# Altium schematic sheet MCU.SchDoc
size A3; Revision: D.1(PCB.SCH)
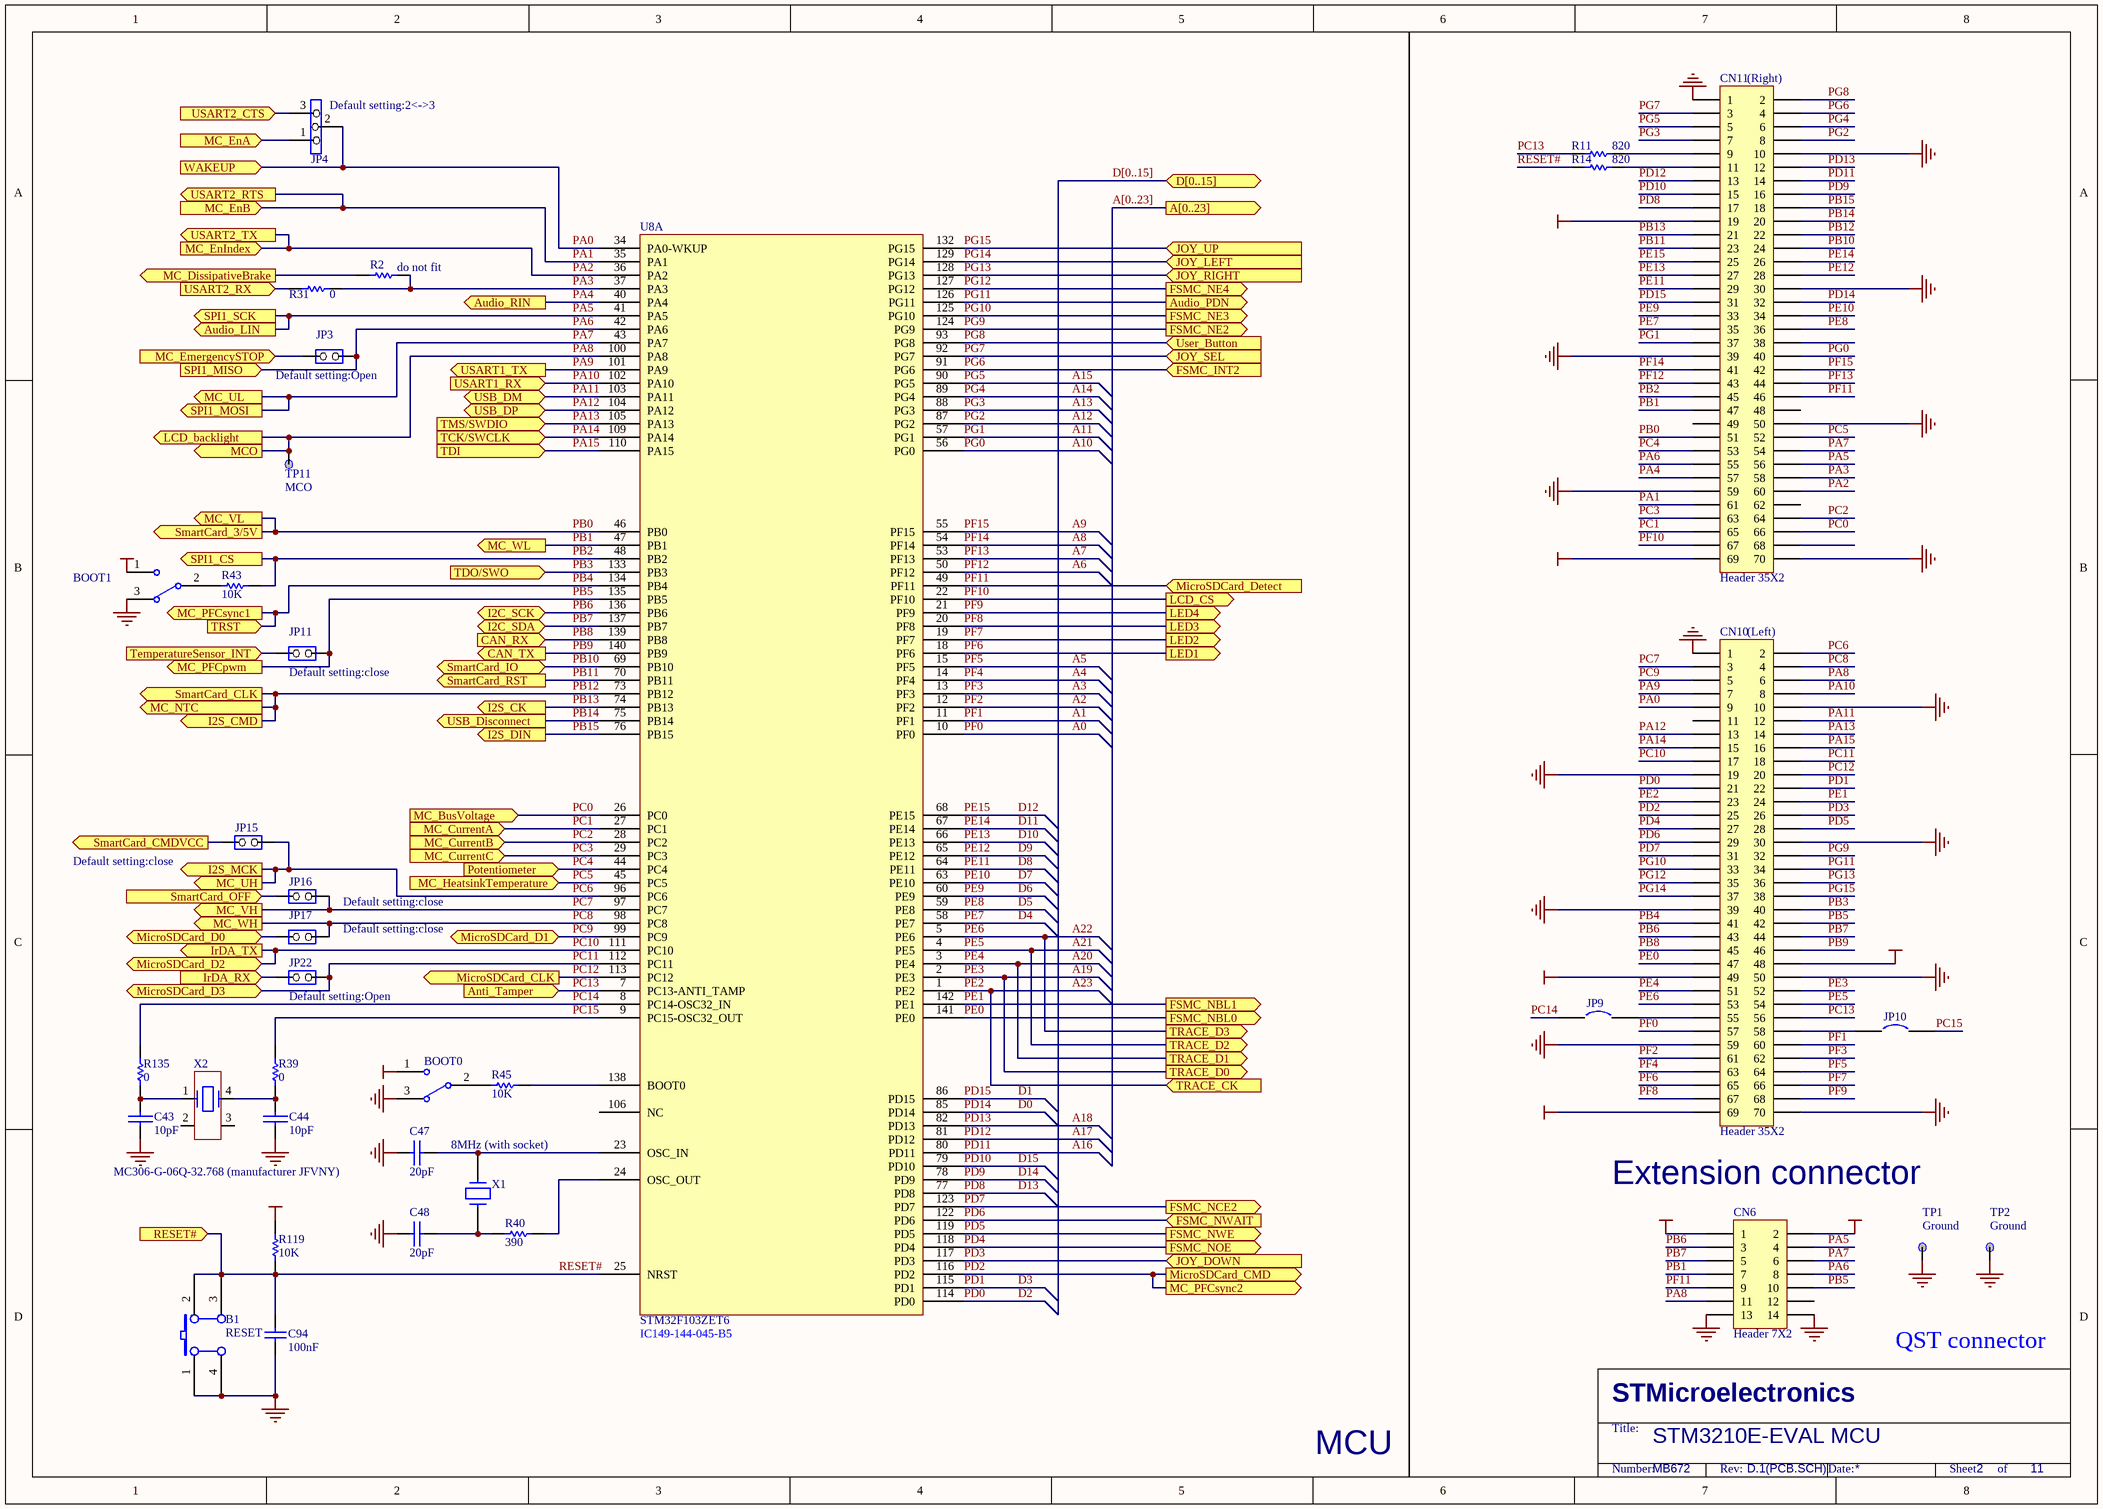
[diagram p0: MCU.SchDoc]

## Parts
B1  RESET  [PB10]
BOOT0  (no value)  [SIP3]
BOOT1  (no value)  [SIP3]
C43  10pF  [0603]
C44  10pF  [0603]
C47  20pF  [0603]
C48  20pF  [0603]
C94  100nF  [0603P]
CN6  Header 7X2  [HDR2X7]
CN10  Header 35X2
CN11  Header 35X2
JP3  (no value)  [SIP2]
JP4  (no value)  [SIP3]
JP9  (no value)  [SPST-2]
JP10  (no value)  [SPST-2]
JP11  (no value)  [SIP2]
JP15  (no value)  [SIP2]
JP16  (no value)  [SIP2]
JP17  (no value)  [SIP2]
JP22  (no value)  [SIP2]
R2  do not fit  [0603]
R11  820  [0603]
R14  820  [0603]
R31  0  [0603]
R39  0  [0805]
R40  390  [0603]
R43  10K  [0603]
R45  10K  [0603]
R119  10K  [0603]
R135  0  [0805]
TP1  Ground  [TP]
TP2  Ground  [TP]
TP11  MCO  [TP]
U8  STM32F103ZET6  (part A of 2)
X1  8MHz (with socket)  [XTAL1]
X2  MC306-G-06Q-32.768 (manufacturer JFVNY)  [SM8]

## Ports
A[0..23] (out), Anti_Tamper (in), Audio_LIN (out), Audio_PDN (out), Audio_RIN (out), CAN_RX (in), CAN_TX (out), D[0..15] (bidir), FSMC_INT2 (in), FSMC_NBL0 (out), FSMC_NBL1 (out), FSMC_NCE2 (out), FSMC_NE2 (out), FSMC_NE3 (out), FSMC_NE4 (out), FSMC_NOE (out), FSMC_NWAIT (in), FSMC_NWE (out), I2C_SCK (bidir), I2C_SDA (bidir), I2S_CK (out), I2S_CMD (out), I2S_DIN (out), I2S_MCK (out), IrDA_RX (in), IrDA_TX (out), JOY_DOWN (in), JOY_LEFT (in), JOY_RIGHT (in), JOY_SEL (in), JOY_UP (in), LCD_backlight (out), LCD_CS (out), LED1 (out), LED2 (out), LED3 (out), LED4 (out), MC_BusVoltage (in), MC_CurrentA (in), MC_CurrentB (in), MC_CurrentC (in), MC_DissipativeBrake (out), MC_EmergencySTOP (in), MC_EnA (in), MC_EnB (in), MC_EnIndex (in), MC_HeatsinkTemperature (in), MC_NTC (out), MC_PFCpwm (out), MC_PFCsync1 (out), MC_PFCsync2 (out), MC_UH (out), MC_UL (out), MC_VH (out), MC_VL (out), MC_WH (out), MC_WL (out), MCO (out), MicroSDCard_CLK (out), MicroSDCard_CMD (out), MicroSDCard_D0 (bidir), MicroSDCard_D1 (bidir), MicroSDCard_D2 (bidir), MicroSDCard_D3 (bidir), MicroSDCard_Detect (in), Potentiometer (in), RESET# (in), SmartCard_3/5V (out), SmartCard_CLK (out), SmartCard_CMDVCC (out), SmartCard_IO (bidir), SmartCard_OFF (in), SmartCard_RST (out), SPI1_CS (out), SPI1_MISO (in), SPI1_MOSI (out), SPI1_SCK (out), TCK/SWCLK (in), TDI (in), TDO/SWO (in), TemperatureSensor_INT (in), TMS/SWDIO (in), TRACE_CK (in), TRACE_D0 (out), TRACE_D1 (out), TRACE_D2 (out), TRACE_D3 (out), TRST (in), USART1_RX (in), USART1_TX (out), USART2_CTS (in), USART2_RTS (out), USART2_RX (in), USART2_TX (out), USB_Disconnect (out), USB_DM (bidir), USB_DP (bidir), User_Button (in), WAKEUP (in)

## Nets
+3V3: BOOT0.1 BOOT1.1 CN10.48 CN10.69 CN11.69 R119.2
+5V: CN6.1 CN6.2
D5V: CN10.49 CN11.19
GND: B1.1(A0) B1.4(A1) BOOT0.3 BOOT1.3 C43.2 C44.2 C47.2 C48.2 C94.1 CN6.13 CN6.14 CN10.1 CN10.10 CN10.19 CN10.30 CN10.39 CN10.50 CN10.59 CN10.70 CN11.1 CN11.10 CN11.30 CN11.39 CN11.50 CN11.59 CN11.70 TP1.1 TP2.1
A0: CN10.57 U8.10(PF0)  [also labelled PF0]
A1: CN10.60 U8.11(PF1)  [also labelled PF1]
A2: CN10.61 U8.12(PF2)  [also labelled PF2]
A3: CN10.62 U8.13(PF3)  [also labelled PF3]
A4: CN10.63 U8.14(PF4)  [also labelled PF4]
A5: CN10.64 U8.15(PF5)  [also labelled PF5]
A6: CN11.43 U8.50(PF12)  [also labelled PF12]
A7: CN11.44 U8.53(PF13)  [also labelled PF13]
A8: CN11.41 U8.54(PF14)  [also labelled PF14]
A9: CN11.42 U8.55(PF15)  [also labelled PF15]
A10: CN11.40 U8.56(PG0)  [also labelled PG0]
A11: CN11.37 U8.57(PG1)  [also labelled PG1]
A12: CN11.8 U8.87(PG2)  [also labelled PG2]
A13: CN11.7 U8.88(PG3)  [also labelled PG3]
A14: CN11.6 U8.89(PG4)  [also labelled PG4]
A15: CN11.5 U8.90(PG5)  [also labelled PG5]
A16: CN11.14 U8.80(PD11)  [also labelled PD11]
A17: CN11.13 U8.81(PD12)  [also labelled PD12]
A18: CN11.12 U8.82(PD13)  [also labelled PD13]
A19: CN10.52 U8.2(PE3) ; port TRACE_D0  [also labelled PE3]
A20: CN10.51 U8.3(PE4) ; port TRACE_D1  [also labelled PE4]
A21: CN10.54 U8.4(PE5) ; port TRACE_D2  [also labelled PE5]
A22: CN10.53 U8.5(PE6) ; port TRACE_D3  [also labelled PE6]
A23: CN10.23 U8.1(PE2) ; port TRACE_CK  [also labelled PE2]
D0: CN11.32 U8.85(PD14)  [also labelled PD14]
D1: CN11.31 U8.86(PD15)  [also labelled PD15]
D2: CN10.21 U8.114(PD0)  [also labelled PD0]
D3: CN10.22 U8.115(PD1)  [also labelled PD1]
D4: CN11.35 U8.58(PE7)  [also labelled PE7]
D5: CN11.36 U8.59(PE8)  [also labelled PE8]
D6: CN11.33 U8.60(PE9)  [also labelled PE9]
D7: CN11.34 U8.63(PE10)  [also labelled PE10]
D8: CN11.29 U8.64(PE11)  [also labelled PE11]
D9: CN11.28 U8.65(PE12)  [also labelled PE12]
D10: CN11.27 U8.66(PE13)  [also labelled PE13]
D11: CN11.26 U8.67(PE14)  [also labelled PE14]
D12: CN11.25 U8.68(PE15)  [also labelled PE15]
D13: CN11.17 U8.77(PD8)  [also labelled PD8]
D14: CN11.16 U8.78(PD9)  [also labelled PD9]
D15: CN11.15 U8.79(PD10)  [also labelled PD10]
IrDA_RX: JP22.2(NO) ; port IrDA_RX
MC_DissipativeBrake: R2.2 ; port MC_DissipativeBrake
MC_EmergencySTOP: JP3.2(NO) ; port MC_EmergencySTOP
MC_EnA: JP4.1 ; port MC_EnA
MicroSDCard_D0: JP17.2(NO) ; port MicroSDCard_D0
PA0: CN10.9 JP4.2 U8.34(PA0-WKUP) ; port WAKEUP
PA1: CN11.61 U8.35(PA1) ; port USART2_RTS, port MC_EnB
PA2: CN11.60 U8.36(PA2) ; port USART2_TX, port MC_EnIndex
PA3: CN11.58 R2.1 R31.1 U8.37(PA3)
PA4: CN11.57 U8.40(PA4) ; port Audio_RIN
PA5: CN6.4 CN11.56 U8.41(PA5) ; port SPI1_SCK, port Audio_LIN
PA6: CN6.8 CN11.55 JP3.1(COMMON) U8.42(PA6) ; port SPI1_MISO
PA7: CN6.6 CN11.54 U8.43(PA7) ; port MC_UL, port SPI1_MOSI
PA8: CN6.11 CN10.6 TP11.1 U8.100(PA8) ; port LCD_backlight, port MCO
PA9: CN10.7 U8.101(PA9) ; port USART1_TX
PA10: CN10.8 U8.102(PA10) ; port USART1_RX
PA11: CN10.12 U8.103(PA11) ; port USB_DM
PA12: CN10.13 U8.104(PA12) ; port USB_DP
PA13: CN10.14 U8.105(PA13) ; port TMS/SWDIO
PA14: CN10.15 U8.109(PA14) ; port TCK/SWCLK
PA15: CN10.16 U8.110(PA15) ; port TDI
PB0: CN11.51 U8.46(PB0) ; port MC_VL, port SmartCard_3/5V
PB1: CN6.7 CN11.47 U8.47(PB1) ; port MC_WL
PB2: CN11.45 R43.1 U8.48(PB2) ; port SPI1_CS
PB3: CN10.40 U8.133(PB3) ; port TDO/SWO
PB4: CN10.41 U8.134(PB4) ; port TRST, port MC_PFCsync1
PB5: CN6.10 CN10.42 JP11.1(COMMON) U8.135(PB5) ; port MC_PFCpwm
PB6: CN6.3 CN10.43 U8.136(PB6) ; port I2C_SCK
PB7: CN6.5 CN10.44 U8.137(PB7) ; port I2C_SDA
PB8: CN10.45 U8.139(PB8) ; port CAN_RX
PB9: CN10.46 U8.140(PB9) ; port CAN_TX
PB10: CN11.24 U8.69(PB10) ; port SmartCard_IO
PB11: CN11.23 U8.70(PB11) ; port SmartCard_RST
PB12: CN11.22 U8.73(PB12) ; port I2S_CMD, port MC_NTC, port SmartCard_CLK
PB13: CN11.21 U8.74(PB13) ; port I2S_CK
PB14: CN11.20 U8.75(PB14) ; port USB_Disconnect
PB15: CN11.18 U8.76(PB15) ; port I2S_DIN
PC0: CN11.66 U8.26(PC0) ; port MC_BusVoltage
PC1: CN11.65 U8.27(PC1) ; port MC_CurrentA
PC2: CN11.64 U8.28(PC2) ; port MC_CurrentB
PC3: CN11.63 U8.29(PC3) ; port MC_CurrentC
PC4: CN11.53 U8.44(PC4) ; port Potentiometer
PC5: CN11.52 U8.45(PC5) ; port MC_HeatsinkTemperature
PC6: CN10.2 JP15.1(COMMON) U8.96(PC6) ; port MC_UH, port I2S_MCK
PC7: CN10.3 JP16.1(COMMON) U8.97(PC7) ; port MC_VH
PC8: CN10.4 JP17.1(COMMON) U8.98(PC8) ; port MC_WH
PC9: CN10.5 U8.99(PC9) ; port MicroSDCard_D1
PC10: CN10.17 U8.111(PC10) ; port IrDA_TX, port MicroSDCard_D2
PC11: CN10.18 JP22.1(COMMON) U8.112(PC11) ; port MicroSDCard_D3
PC12: CN10.20 U8.113(PC12) ; port MicroSDCard_CLK
PC13: CN10.56 R11.1 U8.7(PC13-ANTI_TAMP) ; port Anti_Tamper
PC14: JP9.1 R135.2 U8.8(PC14-OSC32_IN)
PC15: JP10.2 R39.2 U8.9(PC15-OSC32_OUT)
PD2: CN10.25 U8.116(PD2) ; port MC_PFCsync2, port MicroSDCard_CMD
PD3: CN10.26 U8.117(PD3) ; port JOY_DOWN
PD4: CN10.27 U8.118(PD4) ; port FSMC_NOE
PD5: CN10.28 U8.119(PD5) ; port FSMC_NWE
PD6: CN10.29 U8.122(PD6) ; port FSMC_NWAIT
PD7: CN10.31 U8.123(PD7) ; port FSMC_NCE2
PE0: CN10.47 U8.141(PE0) ; port FSMC_NBL0
PE1: CN10.24 U8.142(PE1) ; port FSMC_NBL1
PF6: CN10.65 U8.18(PF6) ; port LED1
PF7: CN10.66 U8.19(PF7) ; port LED2
PF8: CN10.67 U8.20(PF8) ; port LED3
PF9: CN10.68 U8.21(PF9) ; port LED4
PF10: CN11.67 U8.22(PF10) ; port LCD_CS
PF11: CN6.9 CN11.46 U8.49(PF11) ; port MicroSDCard_Detect
PG6: CN11.4 U8.91(PG6) ; port FSMC_INT2
PG7: CN11.3 U8.92(PG7) ; port JOY_SEL
PG8: CN11.2 U8.93(PG8) ; port User_Button
PG9: CN10.32 U8.124(PG9) ; port FSMC_NE2
PG10: CN10.33 U8.125(PG10) ; port FSMC_NE3
PG11: CN10.34 U8.126(PG11) ; port Audio_PDN
PG12: CN10.35 U8.127(PG12) ; port FSMC_NE4
PG13: CN10.36 U8.128(PG13) ; port JOY_RIGHT
PG14: CN10.37 U8.129(PG14) ; port JOY_LEFT
PG15: CN10.38 U8.132(PG15) ; port JOY_UP
RESET#: B1.2(B0) B1.3(B1) C94.2 R14.2 R119.1 U8.25(NRST) ; port RESET#
SmartCard_CMDVCC: JP15.2(NO) ; port SmartCard_CMDVCC
SmartCard_OFF: JP16.2(NO) ; port SmartCard_OFF
TemperatureSensor_INT: JP11.2(NO) ; port TemperatureSensor_INT
USART2_CTS: JP4.3 ; port USART2_CTS
USART2_RX: R31.2 ; port USART2_RX
NetBOOT0_2: BOOT0.2 R45.2
NetBOOT1_2: BOOT1.2 R43.2
NetC43_1: C43.1 R135.1 X2.1
NetC44_1: C44.1 R39.1 X2.4
NetC47_1: C47.1 U8.23(OSC_IN) X1.2
NetC48_1: C48.1 R40.2 X1.1
NetCN10_55: CN10.55 JP9.2
NetCN10_58: CN10.58 JP10.1
NetCN11_9: CN11.9 R11.2
NetCN11_11: CN11.11 R14.1
NetR40_1: R40.1 U8.24(OSC_OUT)
NetR45_1: R45.1 U8.138(BOOT0)

Not connected (* = marked no-connect by the designer): CN6 12; CN10 11; CN11 38 48 49 62 68; U8 106(NC); X2 2 3

## Buses and harness runs
bus A[0..23] = port A[0..23]
bus D[0..15] = port D[0..15]

## Notes on the sheet
- (near JP4) Default setting:2<->3
- (near CN11) (Right)
- (near JP3) Default setting:Open
- (near CN10) (Left)
- (near JP11) Default setting:close
- (near JP15) Default setting:close
- Default setting:close
- (near JP22) Default setting:Open
- Extension connector
- (near U8) IC149-144-045-B5
- QST connector
- MCU
- STM3210E-EVAL MCU
- MB672
- 2
- 11
- STMicroelectronics
- Title:
- Number:
- Rev:
- Date:
- Sheet       of

## Library data of the parts
B1 = SW PUSHBUTTON: SE PUSHBUTTON
BOOT0 BOOT1 = SW-SPDT: SPDT Subminiature Toggle Switch, Right Angle Mounting, Vertical Actuation; Revision 1: Jul-2002: Re-released for DXP Platform.; Revision 2: 17-Dec-2003: Schematic revised, PCB Footprint replaced.; Published: 24-Mar-1999; Datasheet: Latest Revision: 05-Dec-2000; Publisher: Altium Limited
C43 C44 C47 C48 = CAP: Capacitor
C94 = CAP: Capacitor; Value: 100pF; Published: 8-Jun-2000; Revision: July-2002: Re-released for DXP Platform.; Publisher: Altium Limited
CN6 = Header 7X2: Header, 7-Pin, Dual row; Revision: 17-Jul-2002: Re-released for DXP Platform.; Publisher: Altium Limited
CN10 CN11 = Header35X2
JP3 JP11 JP15-JP17 JP22 = JP2
JP4 = Jumper3
JP9 JP10 = Circuit Breaker: Published: 24-Mar-1999; Revision: July-2002: Re-released for DXP Platform.; Publisher: Altium Limited
R2 R31 R43 R45 R119 = res1: Resistor; Value: 1K; Published: 8-Jun-2000; Revision: July-2002: Re-released for DXP Platform.; Publisher: Altium Limited
R11 R14 R39 R40 R135 = Res1: Resistor; Value: 1K; Published: 8-Jun-2000; Revision: July-2002: Re-released for DXP Platform.; Publisher: Altium Limited
TP1 TP2 TP11 = TP
U8 = BigPiranha_new
X1 = CRYSTAL
X2 = MC306